# Altium schematic sheet STM32_PWM.SchDoc
size A4
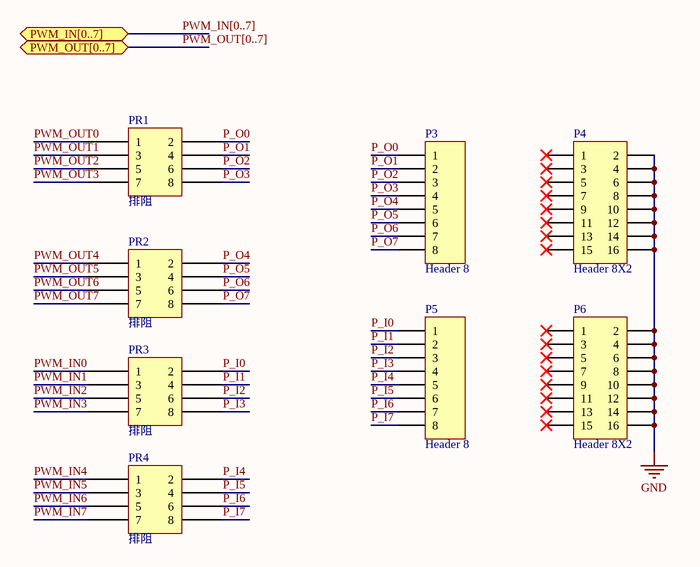
[diagram p0: STM32_PWM.SchDoc]

## Parts
P3  Header 8  [HDR1X8]
P4  Header 8X2  [HDR2X8]
P5  Header 8  [HDR1X8]
P6  Header 8X2  [HDR2X8]
PR1  排阻  [8P4R-0603]
PR2  排阻  [8P4R-0603]
PR3  排阻  [8P4R-0603]
PR4  排阻  [8P4R-0603]

## Ports
PWM_IN[0..7], PWM_OUT[0..7]

## Nets
GND: P4.2 P4.4 P4.6 P4.8 P4.10 P4.12 P4.14 P4.16 P6.2 P6.4 P6.6 P6.8 P6.10 P6.12 P6.14 P6.16
P_I0: P5.1 PR3.2
P_I1: P5.2 PR3.4
P_I2: P5.3 PR3.6
P_I3: P5.4 PR3.8
P_I4: P5.5 PR4.2
P_I5: P5.6 PR4.4
P_I6: P5.7 PR4.6
P_I7: P5.8 PR4.8
P_O0: P3.1 PR1.2
P_O1: P3.2 PR1.4
P_O2: P3.3 PR1.6
P_O3: P3.4 PR1.8
P_O4: P3.5 PR2.2
P_O5: P3.6 PR2.4
P_O6: P3.7 PR2.6
P_O7: P3.8 PR2.8
PWM_IN0: PR3.1
PWM_IN1: PR3.3
PWM_IN2: PR3.5
PWM_IN3: PR3.7
PWM_IN4: PR4.1
PWM_IN5: PR4.3
PWM_IN6: PR4.5
PWM_IN7: PR4.7
PWM_OUT0: PR1.1
PWM_OUT1: PR1.3
PWM_OUT2: PR1.5
PWM_OUT3: PR1.7
PWM_OUT4: PR2.1
PWM_OUT5: PR2.3
PWM_OUT6: PR2.5
PWM_OUT7: PR2.7

Not connected (* = marked no-connect by the designer): P4 1* 3* 5* 7* 9* 11* 13* 15*; P6 1* 3* 5* 7* 9* 11* 13* 15*

## Buses and harness runs
bus PWM_IN[0..7] = port PWM_IN[0..7]
bus PWM_OUT[0..7] = port PWM_OUT[0..7]

## Library data of the parts
P3 P5 = Header 8: Header, 8-Pin; LatestRevisionDate: 17-Jul-2002; LatestRevisionNote: Re-released for DXP Platform.; Publisher: Altium Limited
P4 P6 = Header 8X2: Header, 8-Pin, Dual row; LatestRevisionDate: 17-Jul-2002; LatestRevisionNote: Re-released for DXP Platform.; Publisher: Altium Limited
PR1-PR4 = RES*4